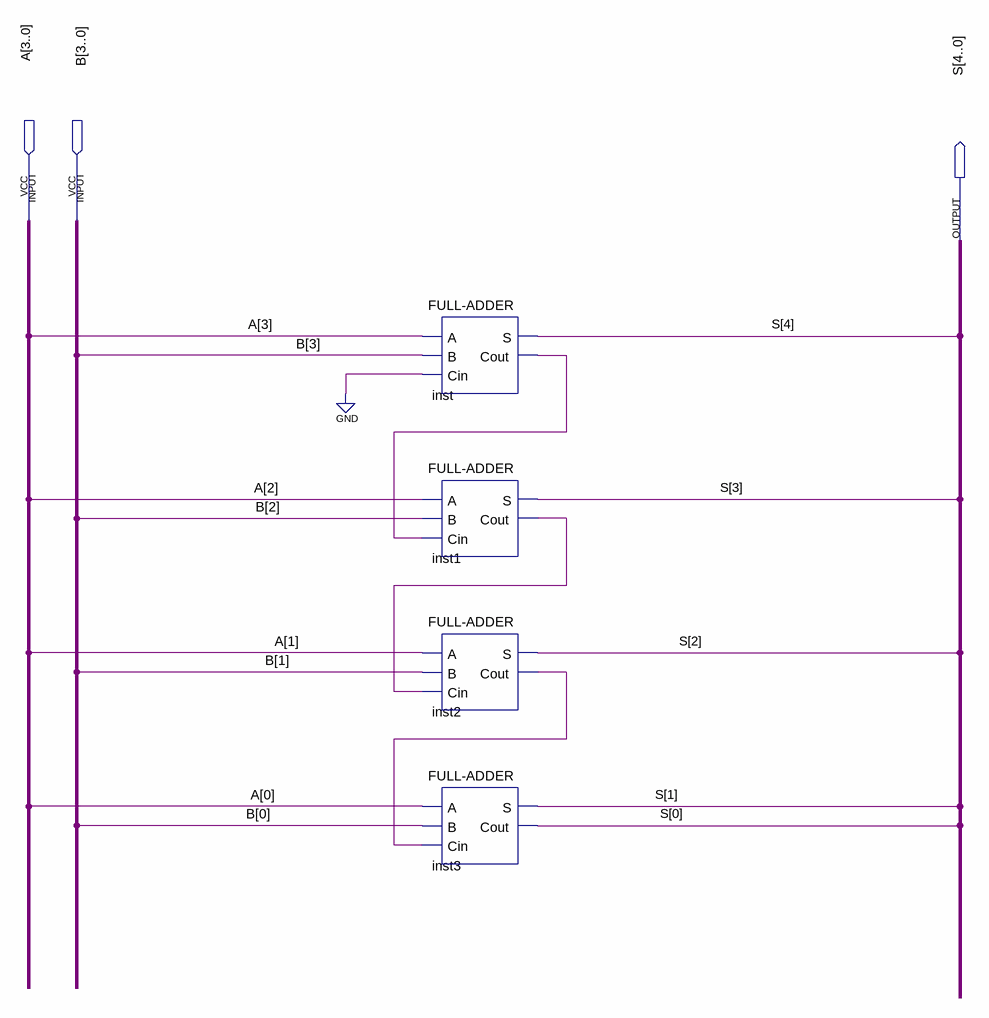
[diagram p0: schematic sheet]
// Quartus schematic four_bit_adder.bdf as structural Verilog: 4 symbols, 3 pins
module four_bit_adder (
  input  [3:0] A,
  input  [3:0] B,
  output [4:0] S
);

  wire inst1_cout, inst2_cout, inst_cout;

  \FULL-ADDER  inst (.A(A[3]), .B(B[3]), .Cin(1'b0), .S(S[4]), .Cout(inst_cout));
  \FULL-ADDER  inst1 (.A(A[2]), .B(B[2]), .Cin(inst_cout), .S(S[3]), .Cout(inst1_cout));
  \FULL-ADDER  inst2 (.A(A[1]), .B(B[1]), .Cin(inst1_cout), .S(S[2]), .Cout(inst2_cout));
  \FULL-ADDER  inst3 (.A(A[0]), .B(B[0]), .Cin(inst2_cout), .S(S[1]), .Cout(S[0]));
endmodule
